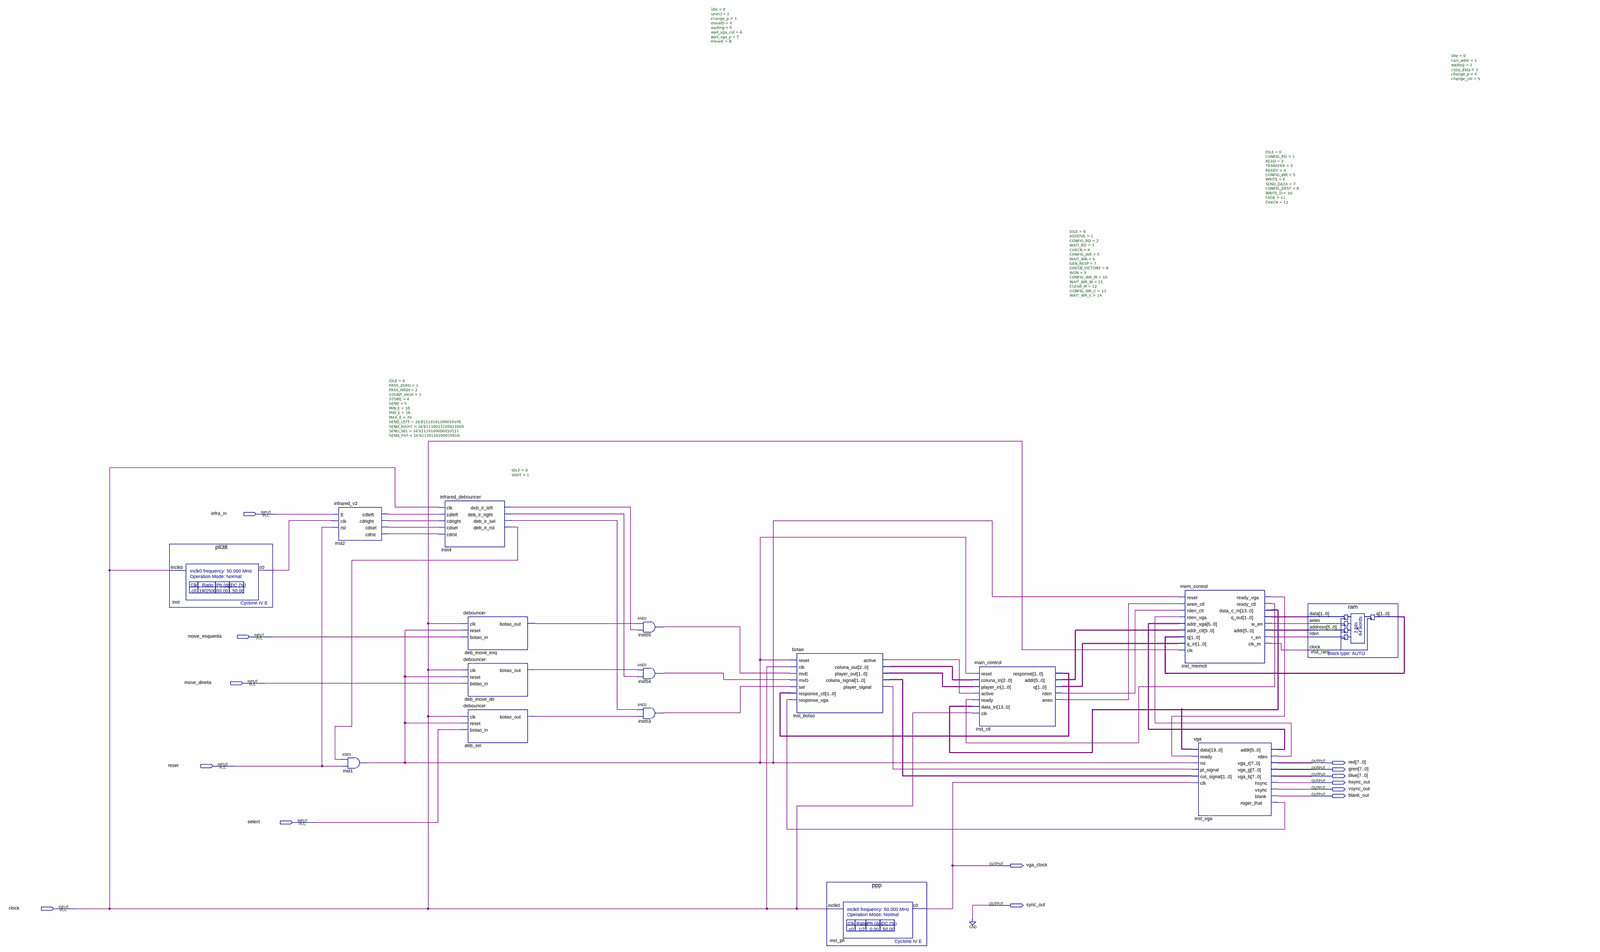
[diagram p0: schematic sheet, whole]
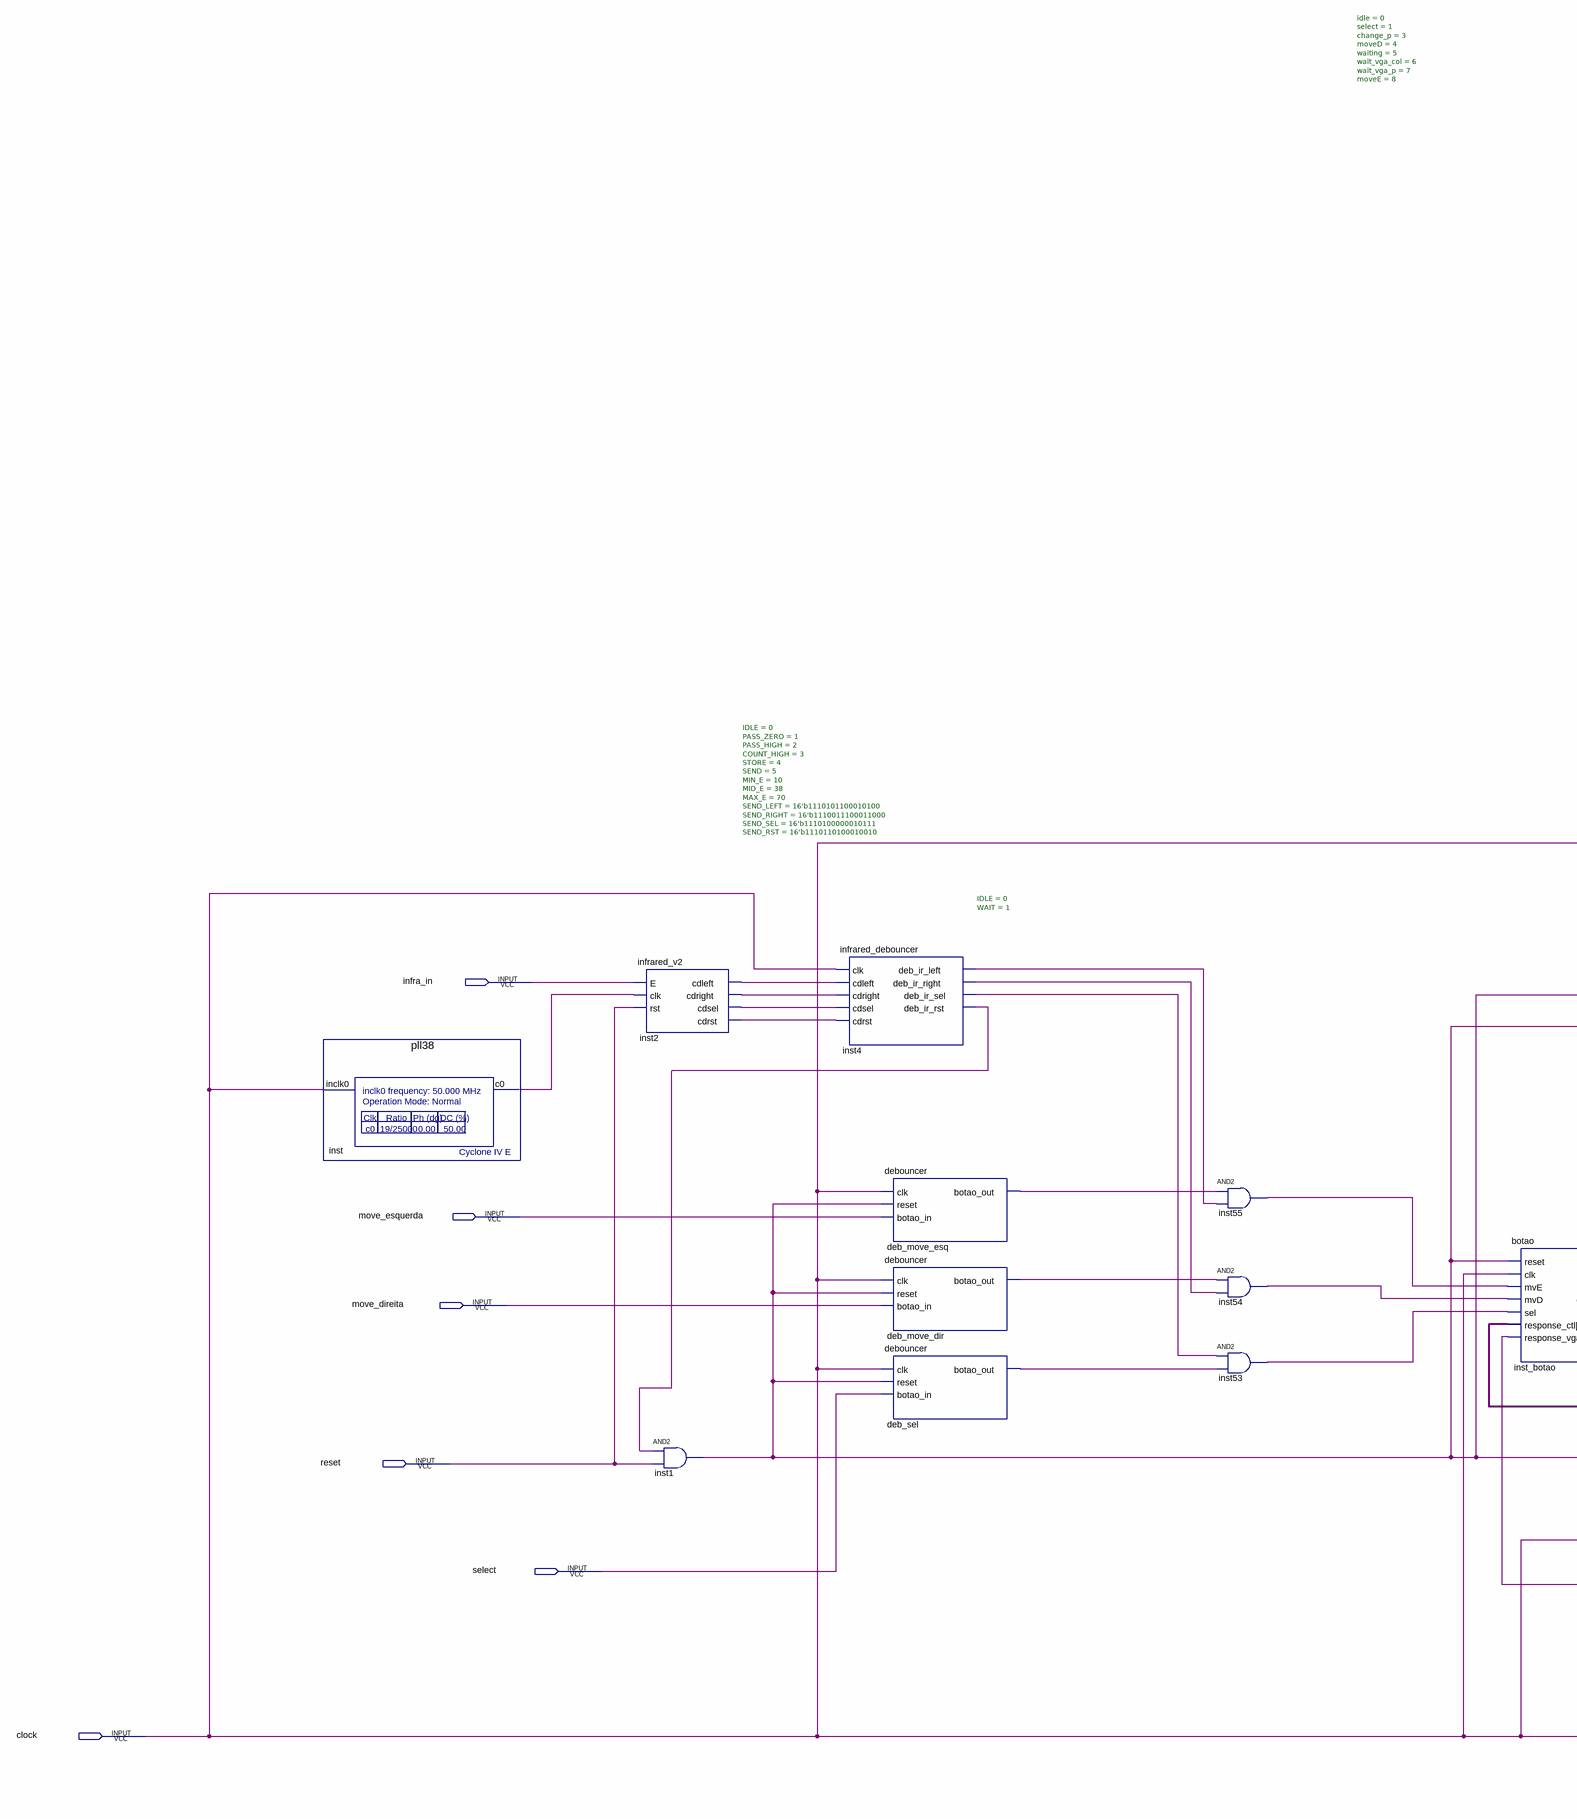
[diagram p1: schematic sheet, left part]
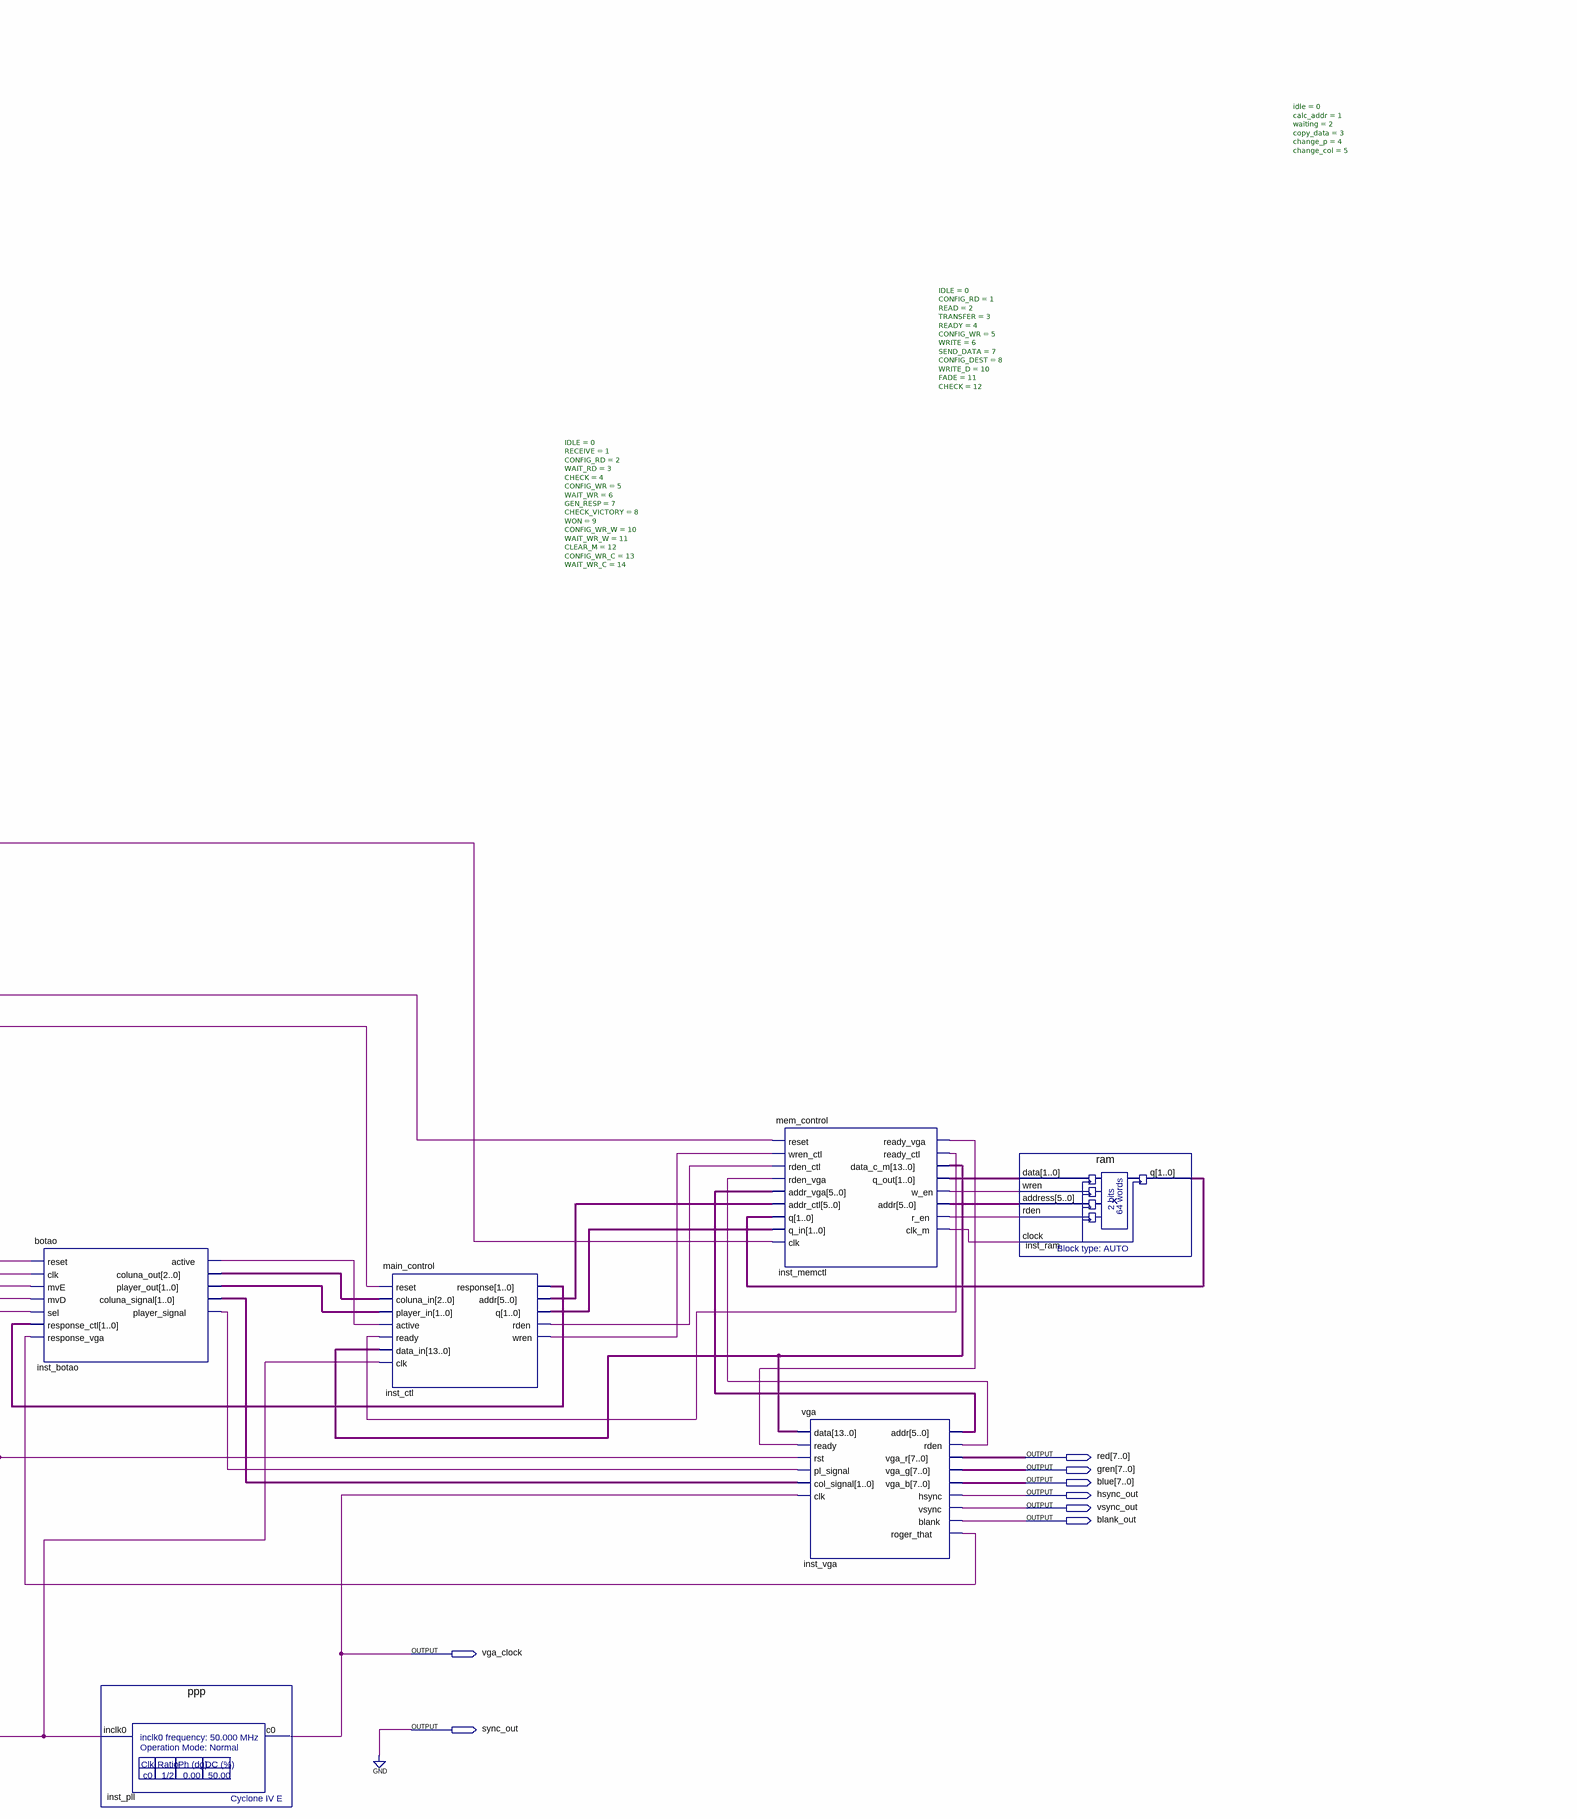
[diagram p2: schematic sheet, right part]
// Quartus schematic vga_main.bdf as structural Verilog: 16 symbols, 14 pins
module vga_main (
  input  infra_in,
  input  move_esquerda,
  input  move_direita,
  input  reset,
  input  select,
  input  clock,
  output [7:0] red,
  output [7:0] gren,
  output [7:0] blue,
  output hsync_out,
  output vsync_out,
  output blank_out,
  output vga_clock,
  output sync_out
);

  wire deb_move_dir_botao_out, deb_move_esq_botao_out, deb_sel_botao_out, inst1_out, inst2_cdleft,
       inst2_cdright, inst2_cdrst, inst2_cdsel, inst4_deb_ir_left, inst4_deb_ir_right, inst4_deb_ir_rst,
       inst4_deb_ir_sel, inst53_out, inst54_out, inst55_out, inst_botao_active, inst_botao_player_signal,
       inst_c0, inst_ctl_rden, inst_ctl_wren, inst_memctl_clk_m, inst_memctl_r_en, inst_memctl_ready_ctl,
       inst_memctl_ready_vga, inst_memctl_w_en, inst_vga_rden, inst_vga_roger_that;
  wire [1:0] inst_botao_coluna_signal, inst_botao_player_out, inst_ctl_q, inst_ctl_response,
       inst_memctl_q_out, inst_ram_q;
  wire [2:0] inst_botao_coluna_out;
  wire [5:0] inst_ctl_addr, inst_memctl_addr, inst_vga_addr;
  wire [13:0] inst_memctl_data_c_m;

  pll38 inst (.inclk0(clock), .c0(inst_c0));
  infrared_v2 #(.IDLE(0), .PASS_ZERO(1), .PASS_HIGH(2), .COUNT_HIGH(3), .STORE(4), .SEND(5), .MIN_E(10), .MID_E(38), .MAX_E(70), .SEND_LEFT(16'b1110101100010100), .SEND_RIGHT(16'b1110011100011000), .SEND_SEL(16'b1110100000010111), .SEND_RST(16'b1110110100010010)) inst2 (
    .E(infra_in), .clk(inst_c0), .rst(reset), .cdleft(inst2_cdleft), .cdright(inst2_cdright),
    .cdsel(inst2_cdsel), .cdrst(inst2_cdrst));
  and inst1 (inst1_out, inst4_deb_ir_rst, reset);
  infrared_debouncer #(.IDLE(0), .WAIT(1)) inst4 (
    .clk(clock), .cdleft(inst2_cdleft), .cdright(inst2_cdright), .cdsel(inst2_cdsel), .cdrst(inst2_cdrst),
    .deb_ir_left(inst4_deb_ir_left), .deb_ir_right(inst4_deb_ir_right), .deb_ir_sel(inst4_deb_ir_sel),
    .deb_ir_rst(inst4_deb_ir_rst));
  debouncer deb_move_esq (.clk(clock), .reset(inst1_out), .botao_in(move_esquerda), .botao_out(deb_move_esq_botao_out));
  debouncer deb_move_dir (.clk(clock), .reset(inst1_out), .botao_in(move_direita), .botao_out(deb_move_dir_botao_out));
  debouncer deb_sel (.clk(clock), .reset(inst1_out), .botao_in(select), .botao_out(deb_sel_botao_out));
  and inst55 (inst55_out, deb_move_esq_botao_out, inst4_deb_ir_left);
  and inst54 (inst54_out, deb_move_dir_botao_out, inst4_deb_ir_right);
  and inst53 (inst53_out, inst4_deb_ir_sel, deb_sel_botao_out);
  botao #(.idle(0), .select(1), .change_p(3), .moveD(4), .waiting(5), .wait_vga_col(6), .wait_vga_p(7), .moveE(8)) inst_botao (
    .reset(inst1_out), .clk(clock), .mvE(inst55_out), .mvD(inst54_out), .sel(inst53_out),
    .response_ctl(inst_ctl_response), .response_vga(inst_vga_roger_that), .active(inst_botao_active),
    .coluna_out(inst_botao_coluna_out), .player_out(inst_botao_player_out),
    .coluna_signal(inst_botao_coluna_signal), .player_signal(inst_botao_player_signal));
  ppp inst_pll (.inclk0(clock), .c0(vga_clock));
  main_control #(.IDLE(0), .RECEIVE(1), .CONFIG_RD(2), .WAIT_RD(3), .CHECK(4), .CONFIG_WR(5), .WAIT_WR(6), .GEN_RESP(7), .CHECK_VICTORY(8), .WON(9), .CONFIG_WR_W(10), .WAIT_WR_W(11), .CLEAR_M(12), .CONFIG_WR_C(13), .WAIT_WR_C(14)) inst_ctl (
    .reset(inst1_out), .coluna_in(inst_botao_coluna_out), .player_in(inst_botao_player_out),
    .active(inst_botao_active), .ready(inst_memctl_ready_ctl), .data_in(inst_memctl_data_c_m), .clk(clock),
    .response(inst_ctl_response), .addr(inst_ctl_addr), .q(inst_ctl_q), .rden(inst_ctl_rden),
    .wren(inst_ctl_wren));
  mem_control #(.IDLE(0), .CONFIG_RD(1), .READ(2), .TRANSFER(3), .READY(4), .CONFIG_WR(5), .WRITE(6), .SEND_DATA(7), .CONFIG_DEST(8), .WRITE_D(10), .FADE(11), .CHECK(12)) inst_memctl (
    .reset(inst1_out), .wren_ctl(inst_ctl_wren), .rden_ctl(inst_ctl_rden), .rden_vga(inst_vga_rden),
    .addr_vga(inst_vga_addr), .addr_ctl(inst_ctl_addr), .q(inst_ram_q), .q_in(inst_ctl_q), .clk(clock),
    .ready_vga(inst_memctl_ready_vga), .ready_ctl(inst_memctl_ready_ctl), .data_c_m(inst_memctl_data_c_m),
    .q_out(inst_memctl_q_out), .w_en(inst_memctl_w_en), .addr(inst_memctl_addr), .r_en(inst_memctl_r_en),
    .clk_m(inst_memctl_clk_m));
  vga #(.idle(0), .calc_addr(1), .waiting(2), .copy_data(3), .change_p(4), .change_col(5)) inst_vga (
    .data(inst_memctl_data_c_m), .ready(inst_memctl_ready_vga), .rst(inst1_out),
    .pl_signal(inst_botao_player_signal), .col_signal(inst_botao_coluna_signal), .clk(vga_clock),
    .addr(inst_vga_addr), .rden(inst_vga_rden), .vga_r(red), .vga_g(gren), .vga_b(blue), .hsync(hsync_out),
    .vsync(vsync_out), .blank(blank_out), .roger_that(inst_vga_roger_that));
  ram inst_ram (
    .data(inst_memctl_q_out), .wren(inst_memctl_w_en), .address(inst_memctl_addr), .rden(inst_memctl_r_en),
    .clock(inst_memctl_clk_m), .q(inst_ram_q));

  assign sync_out = 1'b0;
endmodule
